# Altium project PROC114E3_SCH.PrjPcb (part 3 of 22)

## Sheet 12.SchDoc
size 513 x 386 mm
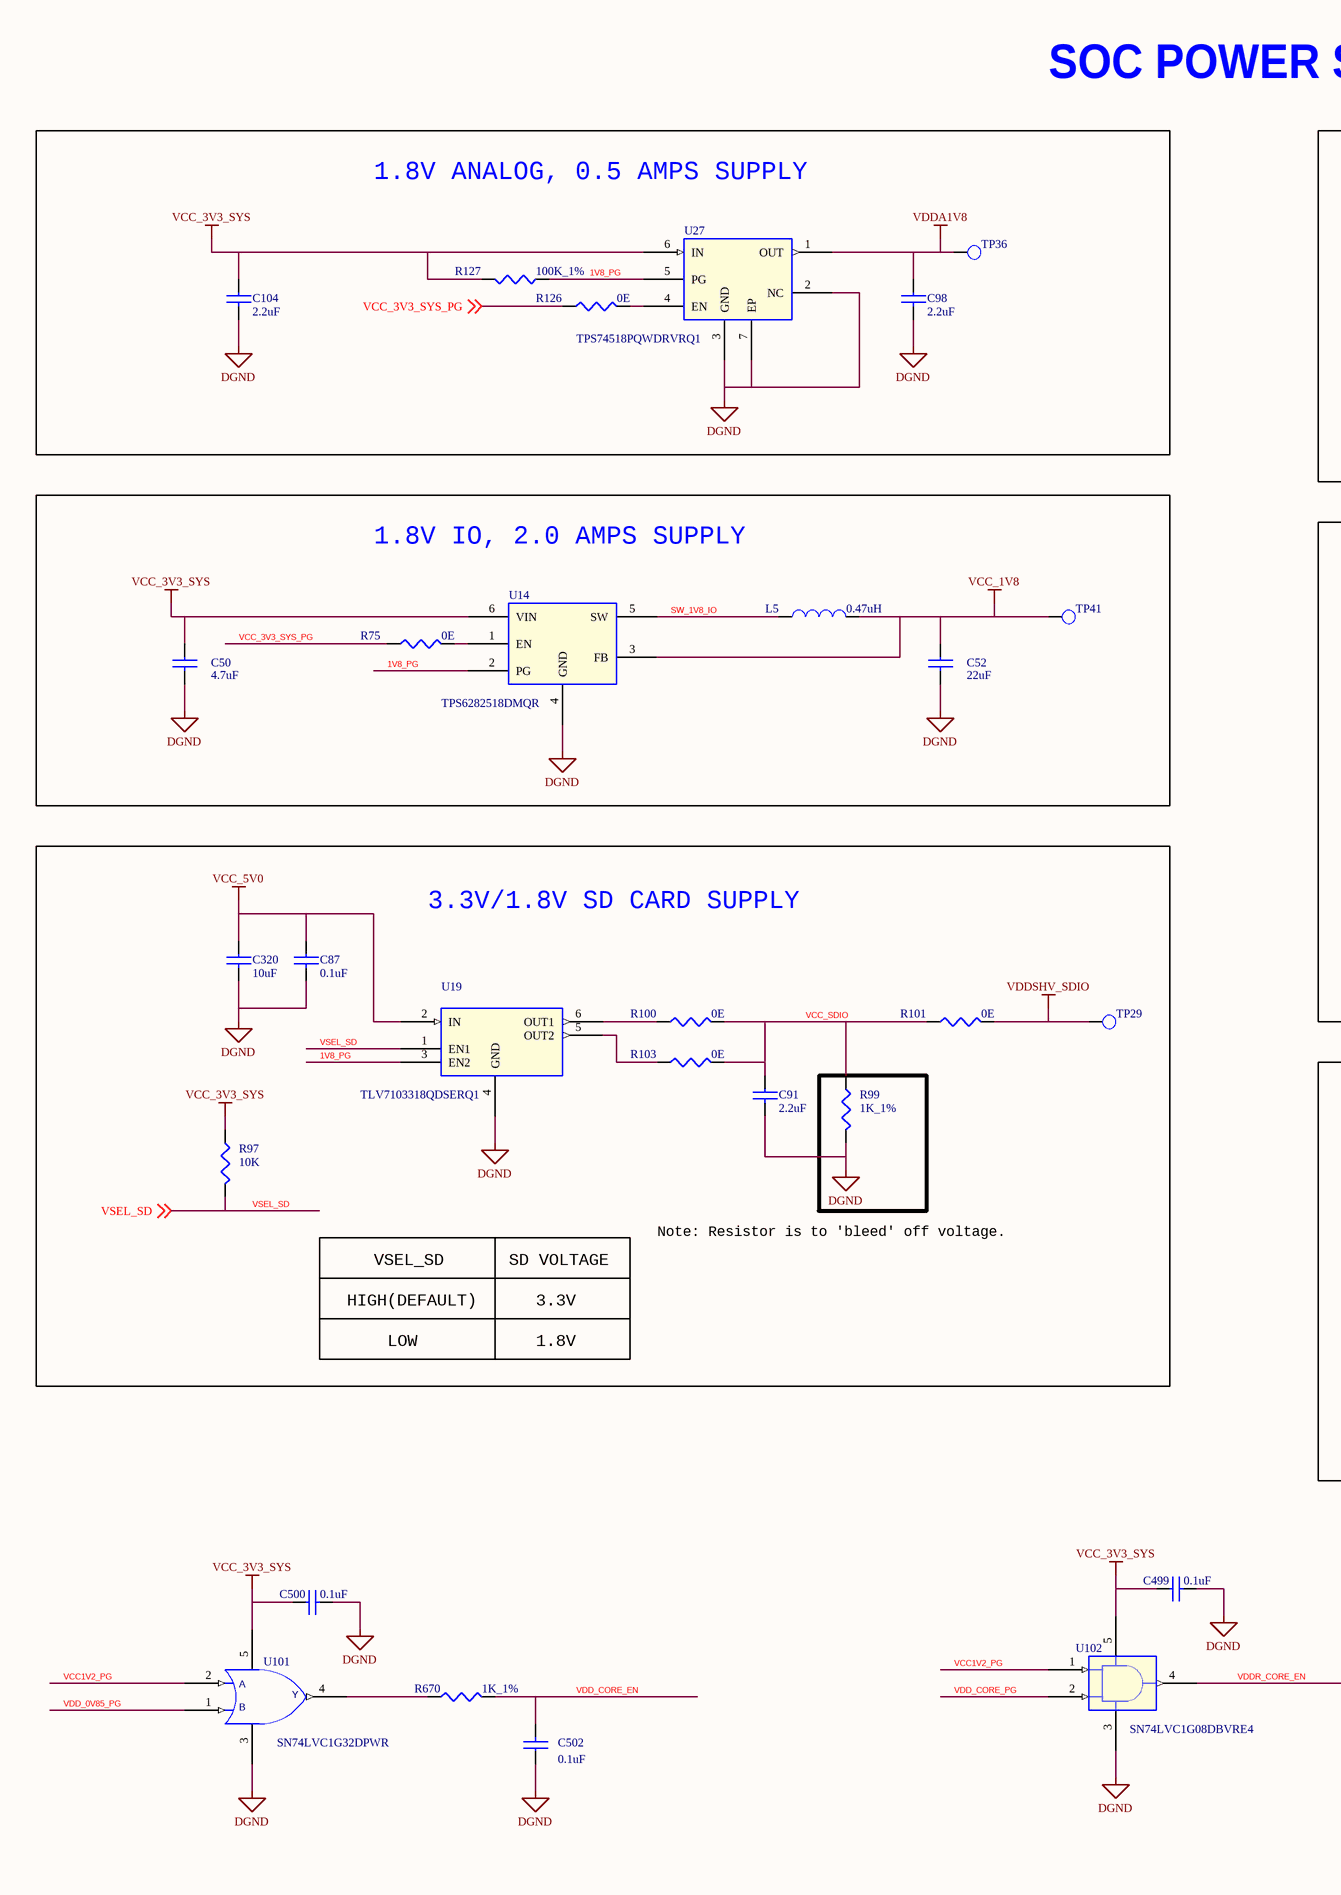
[diagram p13: 12.SchDoc, left]
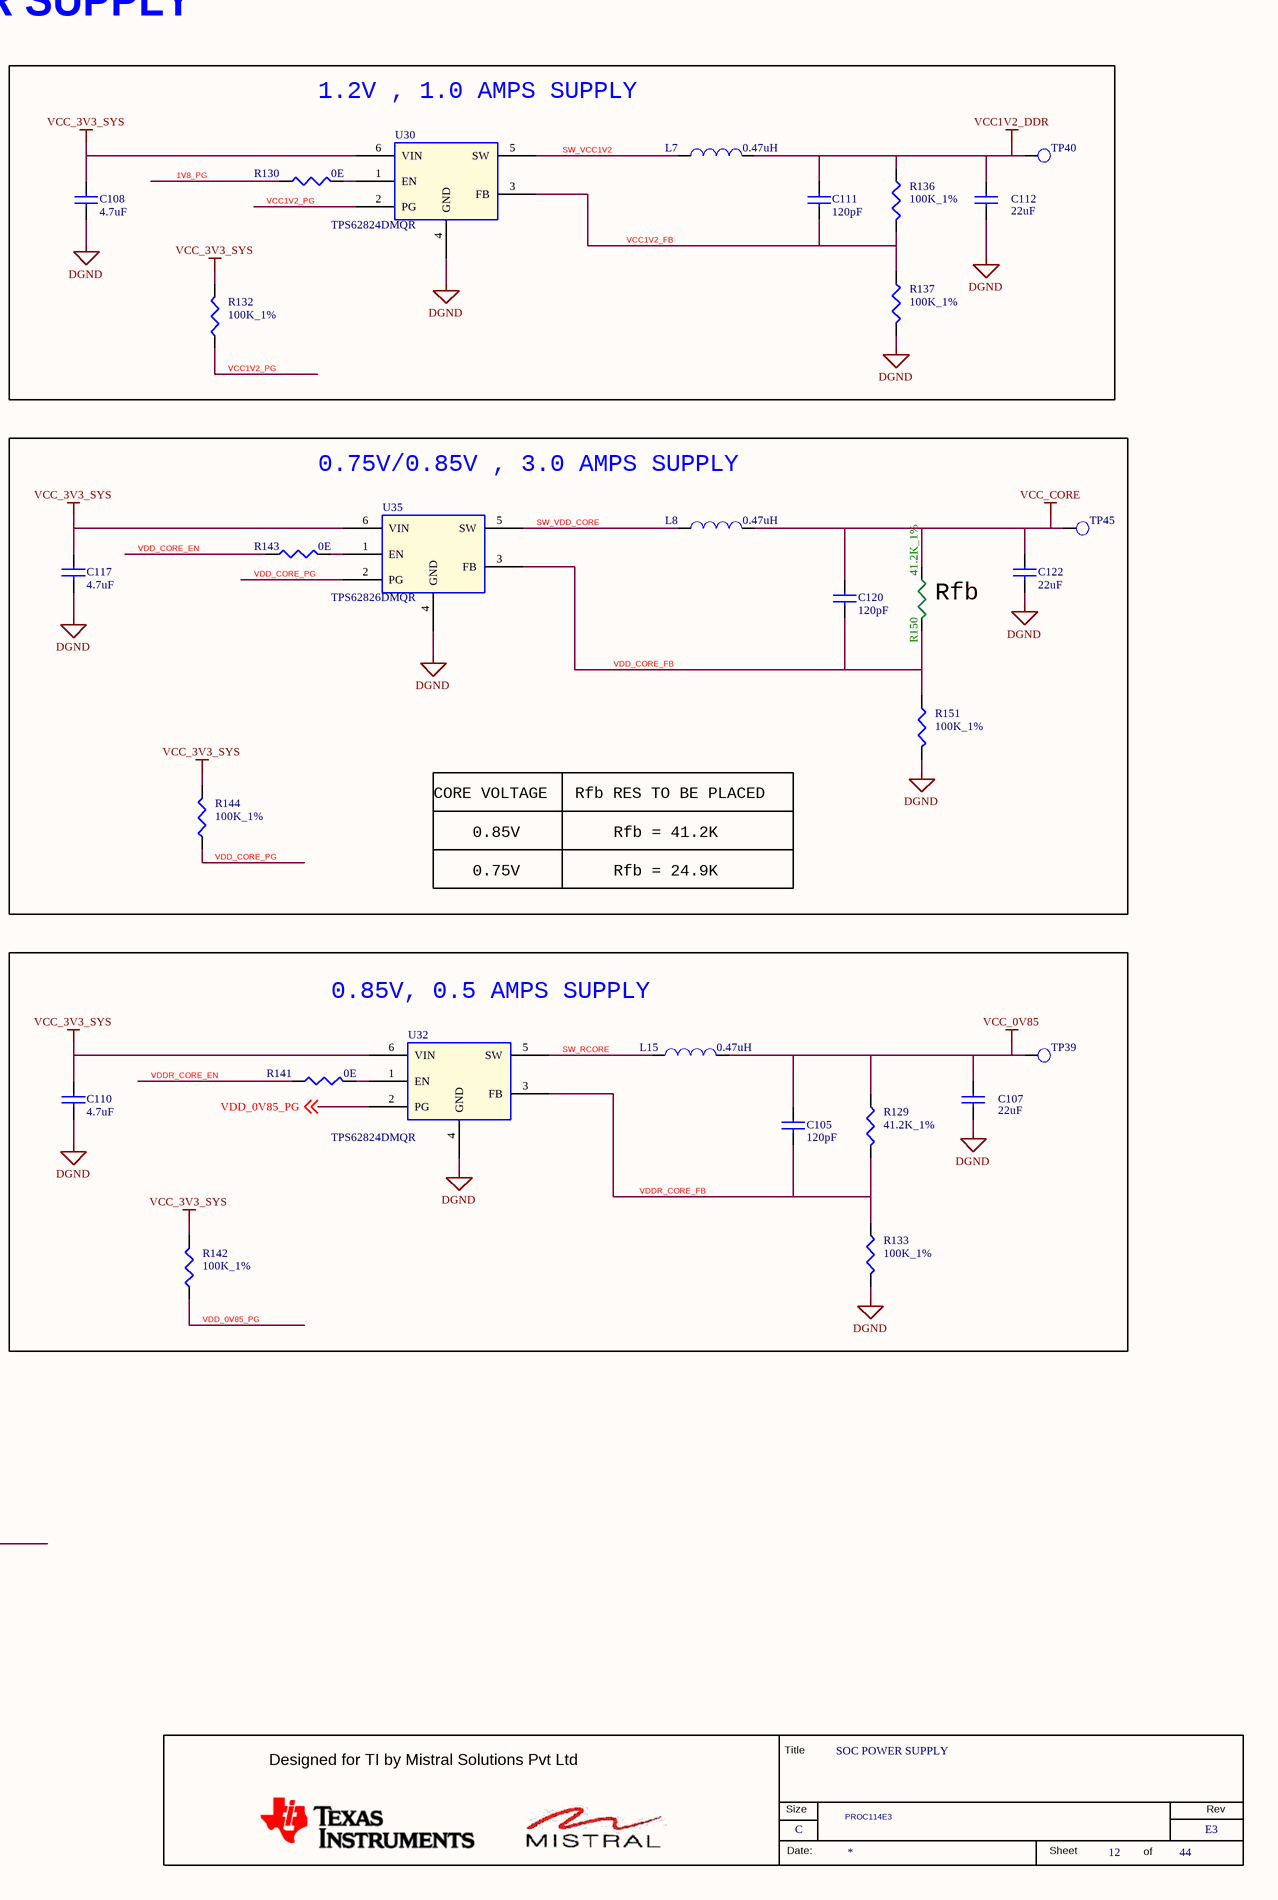
[diagram p14: 12.SchDoc, right]

### Parts
(Parts that share a designator on the sheet are numbered #1, #2 ... from top to bottom, then left to right.)
*#12  RevCode: E3  Title: SOC POWER SUPPLY  Page Size: C  Page Number: 12  Page Count: 44  Variant Name: PROC114E3  (hidden comment: MISTRAL_TITLEBLK_CSIZE)  (graphical)
C50  4.7uF  [CAP0603_1]
C52  22uF  [CAP0603_1]
C87  0.1uF  [CAP0402_0-75]
C91  2.2uF  [CAP0402_0-75]
C98  2.2uF  [CAP0402_0-75]
C104  2.2uF  [CAP0402_0-75]
C105  120pF  [CAP0201_0-5]
C107  22uF  [CAP0603_1]
C108  4.7uF  [CAP0603_1]
C110  4.7uF  [CAP0603_1]
C111  120pF  [CAP0201_0-5]
C112  22uF  [CAP0603_1]
C117  4.7uF  [CAP0603_1]
C120  120pF  [CAP0201_0-5]
C122  22uF  [CAP0603_1]
C320  10uF  [CAP0603_1]
C499  0.1uF  [CAP0402_0-75]
C500  0.1uF  [CAP0402_0-75]
C502  0.1uF  [CAP0402_0-75]
L5  0.47uH  [IND0806_1-2]
L7  0.47uH  [IND0806_1-2]
L8  0.47uH  [IND_IHLP1212AE-11_130X130_SMD_1-5]
L15  0.47uH  [IND_IHLP1212AE-11_130X130_SMD_1-5]
R75  0E  [RES0201_0-5]
R97  10K  [RES0201_0-5]
R99  1K_1%  [RES0402_0-5]
R100  0E  [RES0402_0-5]
R101  0E  [RES0805_0-75]
R103  0E  [RES0402_0-5]
R126  0E  [RES0201_0-5]
R127  100K_1%  [RES0402_0-5]
R129  41.2K_1%  [RES0402_0-5]
R130  0E  [RES0201_0-5]
R132  100K_1%  [RES0402_0-5]
R133  100K_1%  [RES0402_0-5]
R136  100K_1%  [RES0402_0-5]
R137  100K_1%  [RES0402_0-5]
R141  0E  [RES0201_0-5]
R142  100K_1%  [RES0402_0-5]
R143  0E  [RES0201_0-5]
R144  100K_1%  [RES0402_0-5]
R150  41.2K_1%  [RES0402_0-5]
R151  100K_1%  [RES0402_0-5]
R670  1K_1%  [RES0402_0-5]
TP29  TP20_SMD  [TP20_SMD]  (value not drawn)
TP36  TP20_SMD  [TP20_SMD]  (value not drawn)
TP39  TP20_SMD  [TP20_SMD]  (value not drawn)
TP40  TP20_SMD  [TP20_SMD]  (value not drawn)
TP41  TP20_SMD  [TP20_SMD]  (value not drawn)
TP45  TP20_SMD  [TP20_SMD]  (value not drawn)
U14  TPS6282518DMQR  [VSONHR6_TPS62826_60X60_1]
U19  TLV7103318QDSERQ1  [WSON6_TPS717_60X60_0-8]
U27  TPS74518PQWDRVRQ1  [SON6_25-59_85X85_0-8]
U30  TPS62824DMQR  [VSONHR6_TPS62826_60X60_1]
U32  TPS62824DMQR  [VSONHR6_TPS62826_60X60_1]
U35  TPS62826DMQR  [VSONHR6_TPS62826_60X60_1]
U101  SN74LVC1G32DPWR  [X2SON5_TLV7021_30X30_0-4]
U102  SN74LVC1G08DBVRE4  [SOT23-5]

### Blocks framed on the sheet
1.8V ANALOG, 0.5 AMPS SUPPLY: C98 C104 R126 R127 TP36 U27
1.2V , 1.0 AMPS SUPPLY: C108 C111 C112 L7 R130 R132 R136 R137 TP40 U30
1.8V IO, 2.0 AMPS SUPPLY: C50 C52 L5 R75 TP41 U14
3.3V/1.8V SD CARD SUPPLY: C87 C91 C320 R97 R99-R101 R103 TP29 U19
0.85V, 0.5 AMPS SUPPLY: C105 C107 C110 L15 R129 R133 R141 R142 TP39 U32

### Nets
DGND: C50.2 C52.2 C87.2 C91.2 C98.2 C104.2 C107.2 C108.2 C110.2 C112.2 C117.2 C122.2 C320.2 C499.2 C500.2 C502.1 R99.2 R133.2 R137.2 R151.2 U14.4(GND) U19.4(GND) U27.2(NC) U27.3(GND) U27.7(EP) U30.4(GND) U32.4(GND) U35.4(GND) U101.3(GND) U102.3(GND)
VCC1V2_DDR: C111.1 C112.1 L7.2 R136.1 TP40.1(TP)
VCC_0V85: C105.1 C107.1 L15.2 R129.1 TP39.1(TP)
VCC_1V8: C52.1 L5.2 TP41.1(TP) U14.3(FB)
VCC_3V3_SYS: C50.1 C104.1 C108.1 C110.1 C117.1 C499.1 C500.1 R97.1 R127.2 R132.2 R142.2 R144.2 U14.6(VIN) U27.6(IN) U30.6(VIN) U32.6(VIN) U35.6(VIN) U101.5(VCC) U102.5(VCC)
VCC_5V0: C87.1 C320.1 U19.2(IN)
VCC_CORE: C120.1 C122.1 L8.2 R150.1 TP45.1(TP)
VDDA1V8: C98.1 TP36.1(TP) U27.1(OUT)
VDDSHV_SDIO: R101.2 TP29.1(TP)
1V8_PG: R127.1 R130.1 U14.2(PG) U19.3(EN2) U27.5(PG)
SW_1V8_IO: L5.1 U14.5(SW)
SW_RCORE: L15.1 U32.5(SW)
SW_VCC1V2: L7.1 U30.5(SW)
SW_VDD_CORE: L8.1 U35.5(SW)
VCC1V2_FB: C111.2 R136.2 R137.1 U30.3(FB)
VCC1V2_PG: R132.1 U30.2(PG) U101.2(A) U102.1(A)
VCC_3V3_SYS_PG: R75.1 R126.1 ; off-sheet VCC_3V3_SYS_PG
VCC_SDIO: C91.1 R99.1 R100.2 R101.1 R103.2
VDD_0V85_PG: R142.1 U32.2(PG) U101.1(B) ; off-sheet VDD_0V85_PG
VDD_CORE_EN: C502.2 R143.1 R670.2
VDD_CORE_FB: C120.2 R150.2 R151.1 U35.3(FB)
VDD_CORE_PG: R144.1 U35.2(PG) U102.2(B)
VDDR_CORE_EN: R141.1 U102.4(Y)
VDDR_CORE_FB: C105.2 R129.2 R133.1 U32.3(FB)
VSEL_SD: R97.2 U19.1(EN1) ; off-sheet VSEL_SD
NetR75_2: R75.2 U14.1(EN)
NetR100_1: R100.1 U19.6(OUT1)
NetR103_1: R103.1 U19.5(OUT2)
NetR126_2: R126.2 U27.4(EN)
NetR130_2: R130.2 U30.1(EN)
NetR141_2: R141.2 U32.1(EN)
NetR143_2: R143.2 U35.1(EN)
NetR670_1: R670.1 U101.4(Y)

### Notes on the sheet
- SOC POWER SUPPLY
- 0.75V/0.85V , 3.0 AMPS SUPPLY
- (near R150) Rfb
- CORE VOLTAGE
- Rfb RES TO BE PLACED
- 0.75V
- 0.85V
- Rfb = 24.9K
- Rfb = 41.2K
- Note: Resistor is to 'bleed' off voltage.
- HIGH(DEFAULT)
- VSEL_SD
- SD VOLTAGE
- 3.3V
- LOW
- 1.8V
- (in symbol MISTRAL_TITLEBLK_CSIZE) Title; Designed for TI by Mistral Solutions Pvt Ltd; Size; Rev; Date:; Sheet; of

### Library data of the parts
*#12 = MISTRAL_TITLEBLK_CSIZE: Issue: 1.0; Page Create Date: March  8, 1995; Page Modify Date: *; Schematic Page Count: 44; Schematic Page Number: 12
C50 C108 C110 = CAP_Dup2: CAP CERAMIC 4.7uF 35V 20% X5R 0603; Part_type: CAPACITORS\CERAMIC; Mfr_part_number: GRM188R6YA475ME15D; Mfr_name: MURATA; Mistral Part No: 120020050017-R; Custom_Duty: 15%; Customs_HS_Code: 85322990; Wattage: NA; Project: SD865_NANOSOM; Footprint Path: Y:\MIS_DATABASE\Library\ALTIUM_TOOL\PCB_FOOTPRINTS\Altium_Footprint_Lib.PcbLib; Library Path: Y:\MIS_DATABASE\Library\ALTIUM_TOOL\SCHEMATICS_PARTS\MS_DISCRETE_Library.schlib; MECHANICAL 3D STEP FILE: CAP0603_1; Chkd/date: MANIRAJA/120520; Crtd /date: ALVY/120520; Datasheet: Y:\MIS_DATABASE\DATASHEETS\CAPACITORS\GRM188R6YA475ME15.PDF; Temperature: -55°C+85°C; Weight: 6.3mg; Height: 1.00MM; Library Ref: CAP; Distributor_part_number: 490-11995-1-ND; Distributor_name: DIGIKEY; Package: 0603; Voltage: 35V; Tolerance: 20%; Footprint Ref: CAP0603_1; PCB Footprint: CAP0603_1
C52 C122 = CAP_Dup2: as C357 on sheet 11; Footprint Ref: CAP0603_1; Tolerance: 20%; Voltage: 10V; Package: 0603; Distributor_name: DIGIKEY; Distributor_part_number: 490-10476-1-ND; Library Ref: CAP; Height: 1.00MM; Weight: 6.3mg; Temperature: -55°C+85°C; Datasheet: Y:\MIS_DATABASE\DATASHEETS\CAPACITORS\GRM188R61A226ME15.PDF; Crtd /date: MANIRAJA/230118; Chkd/date: MANIRAJA/230118; MECHANICAL 3D STEP FILE: CAP0603_1; Library Path: Y:\MIS_DATABASE\Library\ALTIUM_TOOL\SCHEMATICS_PARTS\MS_DISCRETE_Library.schlib; Footprint Path: Y:\MIS_DATABASE\Library\ALTIUM_TOOL\PCB_FOOTPRINTS\Altium_Footprint_Lib.PcbLib; PCB Footprint: CAP0603_1
C87 = CAP_Dup2: as C139 on sheet 09; Footprint Ref: CAP0402_0-75; Tolerance: 10%; Voltage: 50V; Package: 0402; Distributor_name: DIGIKEY; Distributor_part_number: 490-10700-1-ND; Library Ref: CAP; Height: 0.55MM; Weight: 3.1mg; Temperature: -55°C+125°C; Datasheet: Y:\MIS_DATABASE\DATASHEETS\CAPACITORS\GRM155R71H104KE14.PDF; Crtd /date: ALVY/211020; Chkd/date: MANIRAJA/261020; MECHANICAL 3D STEP FILE: CAP0402_0-75; Library Path: Y:\MIS_DATABASE\Library\ALTIUM_TOOL\SCHEMATICS_PARTS\MS_DISCRETE_Library.schlib; Footprint Path: Y:\MIS_DATABASE\Library\ALTIUM_TOOL\PCB_FOOTPRINTS\Altium_Footprint_Lib.PcbLib; PCB Footprint: CAP0402_0-75
C91 C104 = CAP_Dup2: CAP CERAMIC 2.2uF 25V 10% X5R 0402; Mistral Part No: 120015120001-R; Mfr_name: MURATA; Mfr_part_number: GRM155R61E225KE11D; Part_type: CAPACITORS\CERAMIC; Project: TI_AM263X_CC; Wattage: NA; Customs_HS_Code: 85322990; Custom_Duty: 15%; Footprint Ref: CAP0402_0-75; Tolerance: 10%; Voltage: 25V; Package: 0402; Distributor_name: DIGIKEY; Distributor_part_number: 490-12703-1-ND; Library Ref: CAP; Height: 0.70MM; Weight: 1.5mg; Temperature: -55°C+85°C; Datasheet: Y:\MIS_DATABASE\DATASHEETS\CAPACITORS\GRM155R61E225KE11.PDF; Crtd /date: MANIRAJA/010721; Chkd/date: ALVY/010721; MECHANICAL 3D STEP FILE: CAP0402_0-75; Library Path: Y:\MIS_DATABASE\Library\ALTIUM_TOOL\SCHEMATICS_PARTS\MS_DISCRETE_Library.schlib; Footprint Path: Y:\MIS_DATABASE\Library\ALTIUM_TOOL\PCB_FOOTPRINTS\Altium_Footprint_Lib.PcbLib; PCB Footprint: CAP0402_0-75
C98 = CAP_Dup2: CAP CERAMIC 2.2uF 25V 10% X5R 0402; Part_type: CAPACITORS\CERAMIC; Mfr_part_number: GRM155R61E225KE11D; Mfr_name: MURATA; Mistral Part No: 120015120001-R; Custom_Duty: 15%; Customs_HS_Code: 85322990; Wattage: NA; Project: TI_AM263X_CC; Footprint Path: Y:\MIS_DATABASE\Library\ALTIUM_TOOL\PCB_FOOTPRINTS\Altium_Footprint_Lib.PcbLib; Library Path: Y:\MIS_DATABASE\Library\ALTIUM_TOOL\SCHEMATICS_PARTS\MS_DISCRETE_Library.schlib; MECHANICAL 3D STEP FILE: CAP0402_0-75; Chkd/date: ALVY/010721; Crtd /date: MANIRAJA/010721; Datasheet: Y:\MIS_DATABASE\DATASHEETS\CAPACITORS\GRM155R61E225KE11.PDF; Temperature: -55°C+85°C; Weight: 1.5mg; Height: 0.70MM; Library Ref: CAP; Distributor_part_number: 490-12703-1-ND; Distributor_name: DIGIKEY; Package: 0402; Voltage: 25V; Tolerance: 10%; Footprint Ref: CAP0402_0-75; PCB Footprint: CAP0402_0-75
C105 C120 = CAP_Dup2: as C367 on sheet 11; Footprint Path: Y:\MIS_DATABASE\Library\ALTIUM_TOOL\PCB_FOOTPRINTS\Altium_Footprint_Lib.PcbLib; Library Path: Y:\MIS_DATABASE\Library\ALTIUM_TOOL\SCHEMATICS_PARTS\MS_DISCRETE_Library.schlib; MECHANICAL 3D STEP FILE: CAP0201_0-5; Chkd/date: ALVY/260821; Crtd /date: MANIRAJA/260821; Datasheet: Y:\MIS_DATABASE\DATASHEETS\CAPACITORS\GRM033R71E121KA01.PDF; Temperature: -55°C+125°C; Weight: 0.33mg; Height: 0.33MM; Library Ref: CAP; Distributor_part_number: 490-3173-1-ND; Distributor_name: DIGIKEY; Package: 0201; Voltage: 25V; Tolerance: 10%; Footprint Ref: CAP0201_0-5; PCB Footprint: CAP0201_0-5
C107 C112 = CAP_Dup2: CAP CERAMIC 22uF 10V 20% X5R 0603; Part_type: CAPACITORS\CERAMIC; Mfr_part_number: GRM188R61A226ME15D; Mfr_name: MURATA; Mistral Part No: 120014100009-R; Custom_Duty: 15%; Customs_HS_Code: 85322990; Wattage: NA; Project: TI_MAXIE_CPB; Footprint Path: Y:\MIS_DATABASE\Library\ALTIUM_TOOL\PCB_FOOTPRINTS\Altium_Footprint_Lib.PcbLib; Library Path: Y:\MIS_DATABASE\Library\ALTIUM_TOOL\SCHEMATICS_PARTS\MS_DISCRETE_Library.schlib; MECHANICAL 3D STEP FILE: CAP0603_1; Chkd/date: MANIRAJA/230118; Crtd /date: MANIRAJA/230118; Datasheet: Y:\MIS_DATABASE\DATASHEETS\CAPACITORS\GRM188R61A226ME15.PDF; Temperature: -55°C+85°C; Weight: 6.3mg; Height: 1.00MM; Library Ref: CAP; Distributor_part_number: 490-10476-1-ND; Distributor_name: DIGIKEY; Package: 0603; Voltage: 10V; Tolerance: 20%; Footprint Ref: CAP0603_1; PCB Footprint: CAP0603_1
C111 = CAP_Dup2: CAP CERAMIC 120pF 25V 10% X7R 0201; Mistral Part No: 120021080009-R; Mfr_name: MURATA; Mfr_part_number: GRM033R71E121KA01D; Part_type: CAPACITORS\CERAMIC; Project: TI_AM62x SKEVM_BRD; Wattage: NA; Customs_HS_Code: 85322990; Custom_Duty: 15%; Footprint Ref: CAP0201_0-5; Tolerance: 10%; Voltage: 25V; Package: 0201; Distributor_name: DIGIKEY; Distributor_part_number: 490-3173-1-ND; Library Ref: CAP; Height: 0.33MM; Weight: 0.33mg; Temperature: -55°C+125°C; Datasheet: Y:\MIS_DATABASE\DATASHEETS\CAPACITORS\GRM033R71E121KA01.PDF; Crtd /date: MANIRAJA/260821; Chkd/date: ALVY/260821; MECHANICAL 3D STEP FILE: CAP0201_0-5; Library Path: Y:\MIS_DATABASE\Library\ALTIUM_TOOL\SCHEMATICS_PARTS\MS_DISCRETE_Library.schlib; Footprint Path: Y:\MIS_DATABASE\Library\ALTIUM_TOOL\PCB_FOOTPRINTS\Altium_Footprint_Lib.PcbLib; PCB Footprint: CAP0201_0-5
C117 = CAP_Dup2: as C353 on sheet 11; Footprint Ref: CAP0603_1; Tolerance: 20%; Voltage: 35V; Package: 0603; Distributor_name: DIGIKEY; Distributor_part_number: 490-11995-1-ND; Library Ref: CAP; Height: 1.00MM; Weight: 6.3mg; Temperature: -55°C+85°C; Datasheet: Y:\MIS_DATABASE\DATASHEETS\CAPACITORS\GRM188R6YA475ME15.PDF; Crtd /date: ALVY/120520; Chkd/date: MANIRAJA/120520; MECHANICAL 3D STEP FILE: CAP0603_1; Library Path: Y:\MIS_DATABASE\Library\ALTIUM_TOOL\SCHEMATICS_PARTS\MS_DISCRETE_Library.schlib; Footprint Path: Y:\MIS_DATABASE\Library\ALTIUM_TOOL\PCB_FOOTPRINTS\Altium_Footprint_Lib.PcbLib; PCB Footprint: CAP0603_1
C320 = CAP_Dup2: as C150 on sheet 09; Footprint Ref: CAP0603_1; Tolerance: 20%; Voltage: 35V; Package: 0603; Distributor_name: DIGIKEY; Distributor_part_number: 490-13248-1-ND; Library Ref: CAP; Height: 1.00MM; Weight: 9mg; Temperature: -55°C+85°C; Datasheet: Y:\MIS_DATABASE\DATASHEETS\CAPACITORS\GRM188R6YA106MA73.PDF; Crtd /date: ALVY/160519; Chkd/date: MANIRAJA/170519; MECHANICAL 3D STEP FILE: CAP0603_1; Library Path: Y:\MIS_DATABASE\Library\ALTIUM_TOOL\SCHEMATICS_PARTS\MS_DISCRETE_Library.schlib; Footprint Path: Y:\MIS_DATABASE\Library\ALTIUM_TOOL\PCB_FOOTPRINTS\Altium_Footprint_Lib.PcbLib; PCB Footprint: CAP0603_1
C499 C502 = CAP_Dup2: CAP CERAMIC 0.1uF 50V 10% X7R 0402; Alt_Mfr_name: YAGEO AMERICA; Part_type: CAPACITORS\CERAMIC; Mfr_part_number: GRM155R71H104KE14D; Mfr_name: MURATA; Mistral Part No: 120011100014-R; Alt_Mfr_part_number: CC0402KRX5R8BB104; Custom_Duty: 15%; Customs_HS_Code: 85322990; Wattage: NA; Project: J7_CP; PCB Footprint: CAP0402_0-75; Footprint Path: Y:\MIS_DATABASE\Library\ALTIUM_TOOL\PCB_FOOTPRINTS\Altium_Footprint_Lib.PcbLib; Library Path: Y:\MIS_DATABASE\Library\ALTIUM_TOOL\SCHEMATICS_PARTS\MS_DISCRETE_Library.schlib; Footprint Ref: CAP0402_0-75; Library Ref: CAP; MECHANICAL 3D STEP FILE: CAP0402_0-75; Chkd/date: MANIRAJA/261020; Crtd /date: ALVY/211020; Datasheet: Y:\MIS_DATABASE\DATASHEETS\CAPACITORS\GRM155R71H104KE14.PDF; Temperature: -55°C+125°C; Weight: 3.1mg; Height: 0.55MM; Distributor_part_number: 490-10700-1-ND; Distributor_name: DIGIKEY; Package: 0402; Voltage: 50V; Tolerance: 10%
C500 = CAP_Dup2: CAP CERAMIC 0.1uF 50V 10% X7R 0402; Alt_Mfr_part_number: CC0402KRX5R8BB104; Mistral Part No: 120011100014-R; Mfr_name: MURATA; Mfr_part_number: GRM155R71H104KE14D; Part_type: CAPACITORS\CERAMIC; Alt_Mfr_name: YAGEO AMERICA; Project: J7_CP; Wattage: NA; Customs_HS_Code: 85322990; Custom_Duty: 15%; PCB Footprint: CAP0402_0-75; Tolerance: 10%; Voltage: 50V; Package: 0402; Distributor_name: DIGIKEY; Distributor_part_number: 490-10700-1-ND; Height: 0.55MM; Weight: 3.1mg; Temperature: -55°C+125°C; Datasheet: Y:\MIS_DATABASE\DATASHEETS\CAPACITORS\GRM155R71H104KE14.PDF; Crtd /date: ALVY/211020; Chkd/date: MANIRAJA/261020; MECHANICAL 3D STEP FILE: CAP0402_0-75; Library Ref: CAP; Footprint Ref: CAP0402_0-75; Library Path: Y:\MIS_DATABASE\Library\ALTIUM_TOOL\SCHEMATICS_PARTS\MS_DISCRETE_Library.schlib; Footprint Path: Y:\MIS_DATABASE\Library\ALTIUM_TOOL\PCB_FOOTPRINTS\Altium_Footprint_Lib.PcbLib
L5 L7 = INDUCTOR_Dup1: IND CHIP 0.47uH 4.5A 20% 0806; Mfr_part_number: DFE201612E-R47M=P2; Mfr_name: MURATA; Mistral Part No: 130020100030-R; Custom_Duty: 24%; Customs_HS_Code: 85437099; Wattage: NA; Project: AM64X_SKEVM; Footprint Path: Y:\MIS_DATABASE\Library\ALTIUM_TOOL\PCB_FOOTPRINTS\Altium_Footprint_Lib.PcbLib; Library Path: Y:\MIS_DATABASE\Library\ALTIUM_TOOL\SCHEMATICS_PARTS\MS_DISCRETE_Library.schlib; MECHANICAL 3D STEP FILE: IND0806_1-2; Chkd/date: MANIRAJA/121020; Crtd /date: ALVY/121020; Datasheet: Y:\MIS_DATABASE\DATASHEETS\DISCRETES\INDUCTORS\DFE201612E.PDF; Temperature: -40°C+125°C; Weight: 18.8mg; Height: 1.20MM; Library Ref: INDUCTOR; Distributor_part_number: DFE201612E-R47M=P2-ND; Distributor_name: DIGIKEY; Package: 0806; Voltage: NA; Tolerance: 20%; Part_type: INDUCTOR; Footprint Ref: IND0806_1-2; PCB Footprint: IND0806_1-2
L8 L15 = INDUCTOR_Dup1: IND POWER 0.47uH 6.7A 20% SMD; Mfr_part_number: IHLP1212AEERR47M11; Mfr_name: VISHAY; Mistral Part No: 130014070042-R; Custom_Duty: 24%; Customs_HS_Code: 85437099; Wattage: NA; Project: MS_ADE_PSM_PSU; Footprint Path: Y:\MIS_DATABASE\Library\ALTIUM_TOOL\PCB_FOOTPRINTS\Altium_Footprint_Lib.PcbLib; Library Path: Y:\MIS_DATABASE\Library\ALTIUM_TOOL\SCHEMATICS_PARTS\MS_DISCRETE_Library.schlib; MECHANICAL 3D STEP FILE: IND_IHLP1212AE-11_130X130_SMD_1-5; Chkd/date: MANIRAJA/120619; Crtd /date: NAVEED/230714; Datasheet: Y:\MIS_DATABASE\DATASHEETS\DISCRETES\INDUCTORS\IHLP-1212AE-11-SER.PDF; Temperature: -55°C+125°C; Weight: 48mg; Height: 1.50MM; Library Ref: INDUCTOR; Distributor_part_number: 541-1330-1-ND; Distributor_name: DIGIKEY; Package: SMD; Voltage: NA; Tolerance: 20%; Part_type: INDUCTOR; Footprint Ref: IND_IHLP1212AE-11_130X130_SMD_1-5; PCB Footprint: IND_IHLP1212AE-11_130X130_SMD_1-5
R75 R126 R141 = RESISTOR_Dup6: as R157 on sheet 09; Footprint Path: Y:\MIS_DATABASE\Library\ALTIUM_TOOL\PCB_FOOTPRINTS\Altium_Footprint_Lib.PcbLib; Library Path: Y:\MIS_DATABASE\Library\ALTIUM_TOOL\SCHEMATICS_PARTS\MS_DISCRETE_Library.schlib; MECHANICAL 3D STEP FILE: RES0201_0-5; Chkd/date: NAVEED/301214; Crtd /date: MUDDU/120710; Datasheet: Y:\MIS_DATABASE\DATASHEETS\RESISTORS\RCXXXXL-SER_MAR18.PDF; Temperature: -55°C+125°C; Weight: 0.17mg; Height: 0.26MM; Library Ref: RESISTOR; Distributor_part_number: 311-0.0NCT-ND; Distributor_name: DIGIKEY; Package: 0201; Wattage: 1/20W; Tolerance: 5%; Footprint Ref: RES0201_0-5; PCB Footprint: RES0201_0-5
R97 = RESISTOR_Dup6: as R177 on sheet 09; Footprint Path: Y:\MIS_DATABASE\Library\ALTIUM_TOOL\PCB_FOOTPRINTS\Altium_Footprint_Lib.PcbLib; Library Path: Y:\MIS_DATABASE\Library\ALTIUM_TOOL\SCHEMATICS_PARTS\MS_DISCRETE_Library.schlib; MECHANICAL 3D STEP FILE: RES0201_0-5; Chkd/date: MANIRAJA/050517; Crtd /date: MANIRAJA/050517; Datasheet: Y:\MIS_DATABASE\DATASHEETS\RESISTORS\RCXXXXL-SER_MAR18.PDF; Temperature: -55°C+125°C; Weight: 0.17mg; Height: 0.26MM; Library Ref: RESISTOR; Distributor_part_number: 311-10KNCT-ND; Distributor_name: DIGIKEY; Package: 0201; Wattage: 1/20W; Tolerance: 5%; Footprint Ref: RES0201_0-5; PCB Footprint: RES0201_0-5
R99 = RESISTOR_Dup6: as R494 on sheet 09; Footprint Path: Y:\MIS_DATABASE\Library\ALTIUM_TOOL\PCB_FOOTPRINTS\Altium_Footprint_Lib.PcbLib; Library Path: Y:\MIS_DATABASE\Library\ALTIUM_TOOL\SCHEMATICS_PARTS\MS_DISCRETE_Library.schlib; MECHANICAL 3D STEP FILE: RES0402_0-5; Chkd/date: VASANTHA/281216; Crtd /date: MAZHAR/150506; Datasheet: Y:\MIS_DATABASE\DATASHEETS\RESISTORS\PAN-ERJSER_NOV17.PDF; Temperature: -55°C+155°C; Weight: 0.8mg; Height: 0.40MM; Library Ref: RESISTOR; Distributor_part_number: P1.00KLCT-ND; Distributor_name: DIGIKEY; Package: 0402; Wattage: 1/10W; Tolerance: 1%; Footprint Ref: RES0402_0-5; PCB Footprint: RES0402_0-5
R100 = RESISTOR_Dup6: RES 0E 1/16W JUMPER 0402; Part_type: RESISTORS\FIXED; Mfr_part_number: CRCW04020000Z0ED; Mfr_name: VISHAY; Mistral Part No: 110010080019-R; Custom_Duty: 15%; Customs_HS_Code: 85332119; Voltage: NA; Project: PB_BUGBASE; Footprint Path: Y:\MIS_DATABASE\Library\ALTIUM_TOOL\PCB_FOOTPRINTS\Altium_Footprint_Lib.PcbLib; Library Path: Y:\MIS_DATABASE\Library\ALTIUM_TOOL\SCHEMATICS_PARTS\MS_DISCRETE_Library.schlib; MECHANICAL 3D STEP FILE: RES0402_0-5; Chkd/date: VASANTHA/201216; Crtd /date: MUDDU/190810; Datasheet: Y:\MIS_DATABASE\DATASHEETS\RESISTORS\CRCW0603.PDF; Temperature: -55°C+155°C; Weight: 0.65mg; Height: 0.40MM; Library Ref: RESISTOR; Distributor_part_number: 541-0.0JCT-ND; Distributor_name: DIGIKEY; Package: 0402; Wattage: 1/16W; Tolerance: NA; Footprint Ref: RES0402_0-5; PCB Footprint: RES0402_0-5
R101 = RESISTOR_Dup6: RES 0E 1/8W 5% 0805; Part_type: RESISTORS\FIXED; Mfr_part_number: RC0805JR-070RL; Mfr_name: YAGEO AMERICA; Mistral Part No: 110009030074-R; Custom_Duty: 15%; Customs_HS_Code: 85332119; Voltage: NA; Project: ZK_BIOMETRIC; Footprint Path: Y:\MIS_DATABASE\Library\ALTIUM_TOOL\PCB_FOOTPRINTS\Altium_Footprint_Lib.PcbLib; Library Path: Y:\MIS_DATABASE\Library\ALTIUM_TOOL\SCHEMATICS_PARTS\MS_DISCRETE_Library.schlib; MECHANICAL 3D STEP FILE: RES0805_0-75; Chkd/date: VASANTHA/130416; Crtd /date: JEBRAN/020316; Datasheet: Y:\MIS_DATABASE\DATASHEETS\RESISTORS\RCXXXXL-SER_MAR18.PDF; Temperature: -55°C+155°C; Weight: 5.5mg; Height: 0.60MM; Footprint Ref: RES0805_0-75; Library Ref: RESISTOR; Distributor_part_number: 311-0.0ARCT-ND; Distributor_name: DIGIKEY; Package: 0805; Wattage: 1/8W; Tolerance: 5%; PCB Footprint: RES0805_0-75
R103 = RESISTOR_Dup6: as R483 on sheet 09; Footprint Ref: RES0402_0-5; Voltage: NA; Wattage: 1/16W; Package: 0402; Distributor_name: DIGIKEY; Distributor_part_number: 541-0.0JCT-ND; Library Ref: RESISTOR; Height: 0.40MM; Weight: 0.65mg; Temperature: -55°C+155°C; Datasheet: Y:\MIS_DATABASE\DATASHEETS\RESISTORS\CRCW0603.PDF; Crtd /date: MUDDU/190810; Chkd/date: VASANTHA/201216; MECHANICAL 3D STEP FILE: RES0402_0-5; Library Path: Y:\MIS_DATABASE\Library\ALTIUM_TOOL\SCHEMATICS_PARTS\MS_DISCRETE_Library.schlib; Footprint Path: Y:\MIS_DATABASE\Library\ALTIUM_TOOL\PCB_FOOTPRINTS\Altium_Footprint_Lib.PcbLib; PCB Footprint: RES0402_0-5
R127 R133 R137 R142 R144 R151 = RESISTOR_Dup6: as R465 on sheet 09; Tolerance: 1%; Wattage: 1/10W; Package: 0402; Distributor_name: DIGIKEY; Distributor_part_number: P100KLCT-ND; Height: 0.40MM; Weight: 0.8mg; Temperature: -55°C+155°C; Datasheet: Y:\MIS_DATABASE\DATASHEETS\RESISTORS\PAN-ERJSER_NOV17.PDF; Crtd /date: MAZHAR/130306; Chkd/date: VASANTHA/201216; MECHANICAL 3D STEP FILE: RES0402_0-5; Library Ref: RESISTOR; Footprint Ref: RES0402_0-5; Library Path: Y:\MIS_DATABASE\Library\ALTIUM_TOOL\SCHEMATICS_PARTS\MS_DISCRETE_Library.schlib; Footprint Path: Y:\MIS_DATABASE\Library\ALTIUM_TOOL\PCB_FOOTPRINTS\Altium_Footprint_Lib.PcbLib; PCB Footprint: RES0402_0-5
R129 R150 = RESISTOR_Dup6: RES 41.2K 1/16W 1% 0402; Part_type: RESISTORS\FIXED; Mfr_part_number: RC0402FR-0741K2L; Mfr_name: YAGEO AMERICA; Mistral Part No: 110020050005-R; Custom_Duty: 15%; Customs_HS_Code: 85332119; Voltage: NA; Project: TI_AM243x LP EVM; Footprint Path: Y:\MIS_DATABASE\Library\ALTIUM_TOOL\PCB_FOOTPRINTS\Altium_Footprint_Lib.PcbLib; Library Path: Y:\MIS_DATABASE\Library\ALTIUM_TOOL\SCHEMATICS_PARTS\MS_DISCRETE_Library.schlib; MECHANICAL 3D STEP FILE: RES0402_0-5; Chkd/date: ALVY/091220; Crtd /date: MANIRAJA/091220; Datasheet: Y:\MIS_DATABASE\DATASHEETS\RESISTORS\RCXXXXL-SER_MAR18.PDF; Temperature: -55°C+155°C; Weight: 0.65mg; Height: 0.40MM; Library Ref: RESISTOR; Distributor_part_number: YAG3155CT-ND; Distributor_name: DIGIKEY; Package: 0402; Wattage: 1/16W; Tolerance: 1%; Footprint Ref: RES0402_0-5; PCB Footprint: RES0402_0-5
  R129: Manufacturer: YAGEO AMERICA
R130 R143 = RESISTOR_Dup6: as R468 on sheet 09; Footprint Ref: RES0201_0-5; Tolerance: 5%; Wattage: 1/20W; Package: 0201; Distributor_name: DIGIKEY; Distributor_part_number: 311-0.0NCT-ND; Library Ref: RESISTOR; Height: 0.26MM; Weight: 0.17mg; Temperature: -55°C+125°C; Datasheet: Y:\MIS_DATABASE\DATASHEETS\RESISTORS\RCXXXXL-SER_MAR18.PDF; Crtd /date: MUDDU/120710; Chkd/date: NAVEED/301214; MECHANICAL 3D STEP FILE: RES0201_0-5; Library Path: Y:\MIS_DATABASE\Library\ALTIUM_TOOL\SCHEMATICS_PARTS\MS_DISCRETE_Library.schlib; Footprint Path: Y:\MIS_DATABASE\Library\ALTIUM_TOOL\PCB_FOOTPRINTS\Altium_Footprint_Lib.PcbLib; PCB Footprint: RES0201_0-5
R132 R136 = RESISTOR_Dup6: as R471 on sheet 09; Footprint Path: Y:\MIS_DATABASE\Library\ALTIUM_TOOL\PCB_FOOTPRINTS\Altium_Footprint_Lib.PcbLib; Library Path: Y:\MIS_DATABASE\Library\ALTIUM_TOOL\SCHEMATICS_PARTS\MS_DISCRETE_Library.schlib; Footprint Ref: RES0402_0-5; Library Ref: RESISTOR; MECHANICAL 3D STEP FILE: RES0402_0-5; Chkd/date: VASANTHA/201216; Crtd /date: MAZHAR/130306; Datasheet: Y:\MIS_DATABASE\DATASHEETS\RESISTORS\PAN-ERJSER_NOV17.PDF; Temperature: -55°C+155°C; Weight: 0.8mg; Height: 0.40MM; Distributor_part_number: P100KLCT-ND; Distributor_name: DIGIKEY; Package: 0402; Wattage: 1/10W; Tolerance: 1%; PCB Footprint: RES0402_0-5
R670 = RESISTOR_Dup6: as R182 on sheet 09; PCB Footprint: RES0402_0-5; Footprint Ref: RES0402_0-5; Tolerance: 1%; Wattage: 1/10W; Package: 0402; Distributor_name: DIGIKEY; Distributor_part_number: P1.00KLCT-ND; Library Ref: RESISTOR; Height: 0.40MM; Weight: 0.8mg; Temperature: -55°C+155°C; Datasheet: Y:\MIS_DATABASE\DATASHEETS\RESISTORS\PAN-ERJSER_NOV17.PDF; Crtd /date: MAZHAR/150506; Chkd/date: VASANTHA/281216; MECHANICAL 3D STEP FILE: RES0402_0-5; Library Path: Y:\MIS_DATABASE\Library\ALTIUM_TOOL\SCHEMATICS_PARTS\MS_DISCRETE_Library.schlib; Footprint Path: Y:\MIS_DATABASE\Library\ALTIUM_TOOL\PCB_FOOTPRINTS\Altium_Footprint_Lib.PcbLib
TP29 TP36 TP40 TP45 = TESTPOINT: as TP98 on sheet 10; RoHS: NA; Mfr_part_number: TP20_SMD; Part_type: TESTPOINT; Package: SMD; Distributor_name: NA; Distributor_part_number: NA; Height: NA; Crtd /date: MAZHAR/171006; Chkd/date: SHREESHAIL/171006; Tolerance: NA; Voltage: NA; Wattage: NA; Weight: NA; Temperature: NA; Datasheet: NA; MECHANICAL 3D STEP FILE: NA; Library Path: Y:\MIS_DATABASE\Library\ALTIUM_TOOL\SCHEMATICS_PARTS\MS_DISCRETE_Library.schlib; Footprint Path: Y:\MIS_DATABASE\Library\ALTIUM_TOOL\PCB_FOOTPRINTS\Altium_Footprint_Lib.PcbLib; Library Ref: TESTPOINT; Footprint Ref: TP20_SMD; Customs_HS_Code: NA; Custom_Duty: NA; PCB Footprint: TP20_SMD
TP39 TP41 = TESTPOINT: as TP70 on sheet 10; Customs_HS_Code: NA; Footprint Ref: TP20_SMD; Library Ref: TESTPOINT; Footprint Path: Y:\MIS_DATABASE\Library\ALTIUM_TOOL\PCB_FOOTPRINTS\Altium_Footprint_Lib.PcbLib; Library Path: Y:\MIS_DATABASE\Library\ALTIUM_TOOL\SCHEMATICS_PARTS\MS_DISCRETE_Library.schlib; MECHANICAL 3D STEP FILE: NA; Datasheet: NA; Temperature: NA; Weight: NA; Wattage: NA; Voltage: NA; Tolerance: NA; Chkd/date: SHREESHAIL/171006; Crtd /date: MAZHAR/171006; Height: NA; Distributor_part_number: NA; Distributor_name: NA; Package: SMD; Part_type: TESTPOINT; Mfr_part_number: TP20_SMD; Mistral Part No: NA; RoHS: NA; PCB Footprint: TP20_SMD
U14 = TPS62827DMQR_VSONHR6: IC 2A 1.8V STEP-DOWN CONVERTER WITH 1% OUTPUT ACCURACY VSON-HR6; Part_type: ICS\POWER\DC-DC CONVERTER; Mfr_name: TEXAS INSTRUMENTS; Mistral Part No: 142021080020-R; Custom_Duty: 15%; Customs_HS_Code: 85423100; Wattage: NA; Project: TI_AM62x SKEVM_BRD; Footprint Path: Y:\MIS_DATABASE\Library\ALTIUM_TOOL\PCB_FOOTPRINTS\Altium_Footprint_Lib.PcbLib; Library Path: Y:\MIS_DATABASE\Library\ALTIUM_TOOL\SCHEMATICS_PARTS\MS_MISCPOWER_Library.schlib; MECHANICAL 3D STEP FILE: VSONHR6_TPS62826_60X60_1; Chkd/date: MANIRAJA/240821; Crtd /date: ALVY/240821; Datasheet: Y:\MIS_DATABASE\DATASHEETS\ICS\POWER\TPS6282XX-DEC2020.PDF; Temperature: -40°C+125°C; Weight: NA; Height: 1.00MM; Library Ref: TPS62827DMQR_VSONHR6; Distributor_part_number: 296-49520-1-ND; Distributor_name: DIGIKEY; Package: VSON-HR6; Voltage: NA; Tolerance: NA; Mfr_part_number: TPS6282518DMQR; Footprint Ref: VSONHR6_TPS62826_60X60_1; PCB Footprint: VSONHR6_TPS62826_60X60_1
U19 = TLV7103318D_WSON6: IC 200mA 3.3V/1.8V LOW IQ LDO REGULATOR WSON6; Alternate_mfr_part_number_A: TLV7103318DSER; Alternate_mfr_name_A: TEXAS INSTRUMENTS; Part_type: ICS\POWER\VOLTAGE REGULATOR; Mistral Part No: 142018100013-R; Custom_Duty: 15%; Customs_HS_Code: 85423100; Wattage: NA; Project: TI_J7ES_EVM_SOM; Footprint Path: Y:\MIS_DATABASE\Library\ALTIUM_TOOL\PCB_FOOTPRINTS\Altium_Footprint_Lib.PcbLib; Library Path: Y:\MIS_DATABASE\Library\ALTIUM_TOOL\SCHEMATICS_PARTS\MS_MISCPOWER_Library.schlib; MECHANICAL 3D STEP FILE: WSON6_TPS717_60X60_0-8; Chkd/date: MANIRAJA/091018; Crtd /date: MANIRAJA/091018; Datasheet: Y:\MIS_DATABASE\DATASHEETS\ICS\POWER\TLV710331X-Q1.PDF; Temperature: -40°C+125°C; Weight: 9.7mg; Height: 0.80MM; Library Ref: TLV7103318D_WSON6; Distributor_part_number_A: 296-46453-1-ND; Distributor_name_A: DIGIKEY; Distributor_part_number: 296-40641-1-ND; Distributor_name: DIGIKEY; Package: WSON6; Voltage: NA; Tolerance: NA; Mfr_part_number: TLV7103318QDSERQ1; Mfr_name: TEXAS INSTRUMENTS; Footprint Ref: WSON6_TPS717_60X60_0-8; PCB Footprint: WSON6_TPS717_60X60_0-8
U27 = TPS74618_WSON6: IC 1.8V 500mA LDO WITH POWER-GOOD WSON6; Part_type: ICS\POWER\VOLTAGE REGULATOR; Mfr_name: TEXAS INSTRUMENTS; Mistral Part No: 142021010005-R; Custom_Duty: 15%; Customs_HS_Code: 85423100; Wattage: NA; Project: C2_AMPAK_WI-FI DAUGHTER BRD; Footprint Path: Y:\MIS_DATABASE\Library\ALTIUM_TOOL\PCB_FOOTPRINTS\Altium_Footprint_Lib.PcbLib; Library Path: Y:\MIS_DATABASE\Library\ALTIUM_TOOL\SCHEMATICS_PARTS\MS_MISCPOWER_Library.schlib; MECHANICAL 3D STEP FILE: SON6_25-59_85X85_0-8; Chkd/date: MANIRAJA/070121; Crtd /date: ALVY/070121; Datasheet: Y:\MIS_DATABASE\DATASHEETS\ICS\POWER\TPS745-Q1.PDF; Temperature: -40°C+125°C; Weight: NA; Height: 0.80MM; Footprint Ref: SON6_25-59_85X85_0-8; Library Ref: TPS74618_WSON6; Distributor_part_number: 296-TPS74518PQWDRVRQ1CT-ND; Distributor_name: DIGIKEY; Package: WSON6; Voltage: NA; Tolerance: NA; Mfr_part_number: TPS74518PQWDRVRQ1; PCB Footprint: SON6_25-59_85X85_0-8
U30 = TPS62827DMQR_VSONHR6: IC 1A ADJ STEP-DOWN CONVERTER WITH 1% OUTPUT ACCURACY VSON-HR6; Part_type: ICS\POWER\DC-DC CONVERTER; Mfr_name: TEXAS INSTRUMENTS; Mistral Part No: 142021100006-R; Custom_Duty: 15%; Customs_HS_Code: 85423100; Wattage: NA; Project: TI_AM62x SKEVM_BRD; PCB Footprint: VSONHR6_TPS62826_60X60_1; Footprint Path: Y:\MIS_DATABASE\Library\ALTIUM_TOOL\PCB_FOOTPRINTS\Altium_Footprint_Lib.PcbLib; Library Path: Y:\MIS_DATABASE\Library\ALTIUM_TOOL\SCHEMATICS_PARTS\MS_MISCPOWER_Library.schlib; MECHANICAL 3D STEP FILE: VSONHR6_TPS62826_60X60_1; Chkd/date: ALVY/071021; Crtd /date: MANIRAJA/071021; Datasheet: Y:\MIS_DATABASE\DATASHEETS\ICS\POWER\TPS6282XX-DEC2020.PDF; Temperature: -40°C+125°C; Weight: NA; Height: 1.00MM; Library Ref: TPS62827DMQR_VSONHR6; Distributor_part_number: NA; Distributor_name: NA; Package: VSON-HR6; Voltage: NA; Tolerance: NA; Mfr_part_number: TPS62824DMQR; Footprint Ref: VSONHR6_TPS62826_60X60_1
U32 = TPS62827DMQR_VSONHR6: IC 1A ADJ STEP-DOWN CONVERTER WITH 1% OUTPUT ACCURACY VSON-HR6; Mistral Part No: 142021100006-R; Manufacturer: TEXAS INSTRUMENTS; Part_type: ICS\POWER\DC-DC CONVERTER; Project: TI_AM62x SKEVM_BRD; Tolerance: NA; Customs_HS_Code: 85423100; Custom_Duty: 15%; PCB Footprint: VSONHR6_TPS62826_60X60_1; Footprint Ref: VSONHR6_TPS62826_60X60_1; Mfr_part_number: TPS62824DMQR; Voltage: NA; Wattage: NA; Package: VSON-HR6; Distributor_name: NA; Distributor_part_number: NA; Library Ref: TPS62827DMQR_VSONHR6; Height: 1.00MM; Weight: NA; Temperature: -40°C+125°C; Datasheet: Y:\MIS_DATABASE\DATASHEETS\ICS\POWER\TPS6282XX-DEC2020.PDF; Crtd /date: MANIRAJA/071021; Chkd/date: ALVY/071021; MECHANICAL 3D STEP FILE: VSONHR6_TPS62826_60X60_1; Library Path: Y:\MIS_DATABASE\Library\ALTIUM_TOOL\SCHEMATICS_PARTS\MS_MISCPOWER_Library.schlib; Footprint Path: Y:\MIS_DATABASE\Library\ALTIUM_TOOL\PCB_FOOTPRINTS\Altium_Footprint_Lib.PcbLib
U35 = TPS62827DMQR_VSONHR6: IC 3A ADJ STEP-DOWN CONVERTER WITH 1% OUTPUT ACCURACY VSON-HR6; Part_type: ICS\POWER\DC-DC CONVERTER; Mfr_name: TEXAS INSTRUMENTS; Mistral Part No: 142021030014-R; Custom_Duty: 15%; Customs_HS_Code: 85423100; Wattage: NA; Project: TI_AM263x_CC; Footprint Path: Y:\MIS_DATABASE\Library\ALTIUM_TOOL\PCB_FOOTPRINTS\Altium_Footprint_Lib.PcbLib; Library Path: Y:\MIS_DATABASE\Library\ALTIUM_TOOL\SCHEMATICS_PARTS\MS_MISCPOWER_Library.schlib; MECHANICAL 3D STEP FILE: VSONHR6_TPS62826_60X60_1; Crtd /date: ALVY/190321; Datasheet: Y:\MIS_DATABASE\DATASHEETS\ICS\POWER\TPS6282XX-OCT2020.PDF; Temperature: -40°C+125°C; Weight: 5mg; Height: 1.00MM; Library Ref: TPS62827DMQR_VSONHR6; Distributor_part_number: 296-49523-1-ND; Distributor_name: DIGIKEY; Package: VSON-HR6; Voltage: NA; Tolerance: NA; Mfr_part_number: TPS62826DMQR; Footprint Ref: VSONHR6_TPS62826_60X60_1; PCB Footprint: VSONHR6_TPS62826_60X60_1
U101 = SN74LVC1G32_X2SON5: IC SINGLE 2-INPUT POSITIVE-OR GATE X2SON5; Part_type: ICS\DIGITAL\GATES; Mfr_name: TEXAS INSTRUMENTS; Mistral Part No: 141020100011-R; Custom_Duty: 15%; Customs_HS_Code: 85423100; Wattage: NA; Project: AM64X_SKEVM; PCB Footprint: X2SON5_TLV7021_30X30_0-4; Footprint Path: Y:\MIS_DATABASE\Library\ALTIUM_TOOL\PCB_FOOTPRINTS\Altium_Footprint_Lib.PcbLib; Library Path: Y:\MIS_DATABASE\Library\ALTIUM_TOOL\SCHEMATICS_PARTS\MS_GATE_Library.schlib; MECHANICAL 3D STEP FILE: X2SON5_TLV7021_30X30_0-4; Chkd/date: MANIRAJA/141020; Crtd /date: ALVY/131020; Datasheet: Y:\MIS_DATABASE\DATASHEETS\ICS\DIGITAL\GATES\SN74LVC1G32XX.PDF; Temperature: -40°C+125°C; Weight: 0.6mg; Height: 0.40MM; Library Ref: SN74LVC1G32_X2SON5; Distributor_part_number: 296-SN74LVC1G32DPWRCT-ND; Distributor_name: DIGIKEY; Package: X2SON5; Voltage: NA; Tolerance: NA; Mfr_part_number: SN74LVC1G32DPWR; Footprint Ref: X2SON5_TLV7021_30X30_0-4
U102 = SN74LVC1G08DBVRE4_SOT23-5_Dup1: IC SINGLE 2-INPUT POSITIVE AND GATE SOT23-5; Part_type: ICS\DIGITAL\GATES; Mfr_name: TEXAS INSTRUMENTS; Mistral Part No: 141009060026-R; Custom_Duty: 15%; Customs_HS_Code: 85423100; Project: KHAN_MAIN; PCB Footprint: SOT23-5; RoHS: Sb/ Br FREE; Chkd/date: SUHAS/221010; Crtd /date: USMAN/151008; Datasheet: Y:\MIS_DATABASE\DATASHEETS\ICS\DIGITAL\GATES\SN74LVC1G08.PDF; Temperature: -40°C+85°C; Height: 1.45MM; Library Ref: SN74LVC1G08DBVRE4_SOT23-5; Distributor_part_number: SN74LVC1G08DBVRE4-ND; Distributor_name: DIGIKEY; Package: SOT23-5; Mfr_part_number: SN74LVC1G08DBVRE4